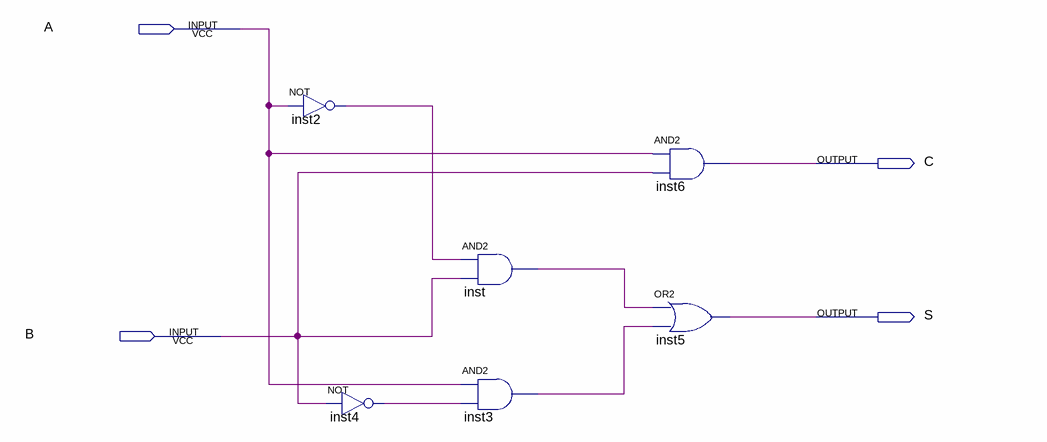
[diagram p0: schematic sheet]
// Quartus schematic OneBitAdderHalf.bdf as structural Verilog: 6 symbols, 4 pins
module OneBitAdderHalf (
  input  A,
  input  B,
  output C,
  output S
);

  wire inst2_out, inst3_out, inst4_out, inst_out;

  not inst2 (inst2_out, A);
  not inst4 (inst4_out, B);
  and inst (inst_out, inst2_out, B);
  and inst3 (inst3_out, A, inst4_out);
  and inst6 (C, A, B);
  or inst5 (S, inst_out, inst3_out);
endmodule
